# Altium schematic sheet [7] Jetson Nano P3.SchDoc: ARS Camera REV01 Jetson Nano P3
size A3; DrawnBy: Manh Ngo Van; Engineer: Manh Ngo Van; Organization: Altium Limited; Address1: L3, 12a Rodborough Rd; Address2: Frenchs Forest; Address3: NSW; Address4: Australia 2086; DocumentNumber: 7; Revision: 1.0; SheetNumber: 7; SheetTotal: 16
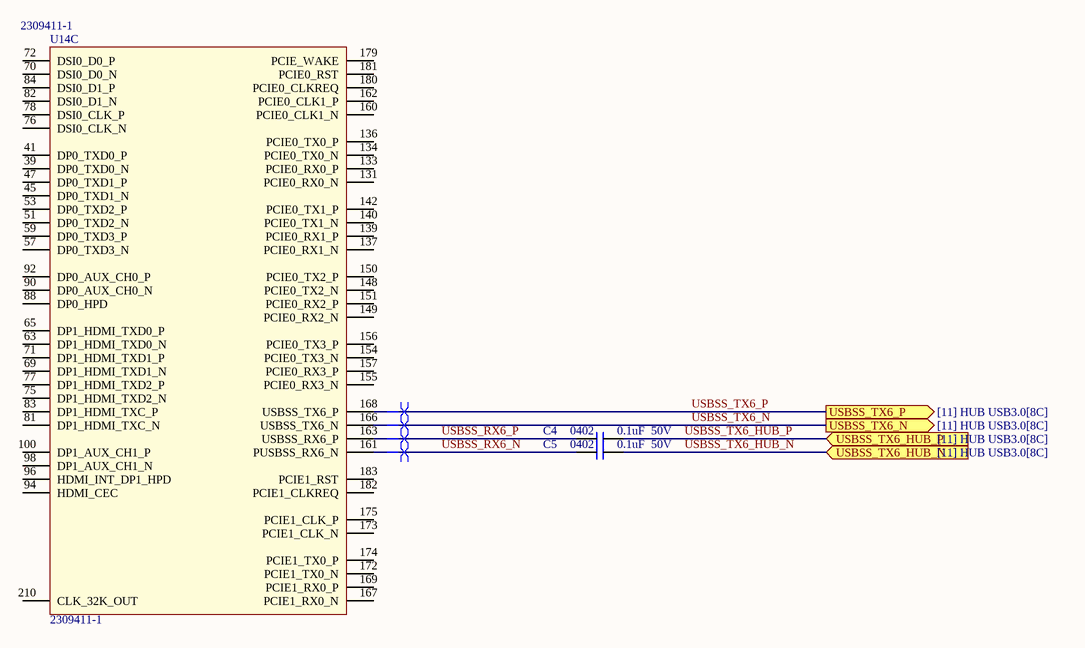
[diagram p0: [7] Jetson Nano P3.SchDoc]

## Parts
C4  0.1uF  Case/Package: 0402  Voltage: 50V  [C0402M]
C5  0.1uF  Case/Package: 0402  Voltage: 50V  [C0402M]
U14  2309411-1  [2309411-1]  (part C of 3)

## Ports
USBSS_TX6_HUB_N (in, see [11] HUB USB3.0[8C]), USBSS_TX6_HUB_P (in, see [11] HUB USB3.0[8C]), USBSS_TX6_N (out, see [11] HUB USB3.0[8C]), USBSS_TX6_P (out, see [11] HUB USB3.0[8C])

## Nets
USBSS_RX6_N: C5.1 U14.161(PUSBSS_RX6_N)
USBSS_RX6_P: C4.1 U14.163(USBSS_RX6_P)
USBSS_TX6_HUB_N: C5.2 ; port USBSS_TX6_HUB_N
USBSS_TX6_HUB_P: C4.2 ; port USBSS_TX6_HUB_P
USBSS_TX6_N: U14.166(USBSS_TX6_N) ; port USBSS_TX6_N
USBSS_TX6_P: U14.168(USBSS_TX6_P) ; port USBSS_TX6_P

Not connected (* = marked no-connect by the designer): U14 39(DP0_TXD0_N) 41(DP0_TXD0_P) 45(DP0_TXD1_N) 47(DP0_TXD1_P) 51(DP0_TXD2_N) 53(DP0_TXD2_P) 57(DP0_TXD3_N) 59(DP0_TXD3_P) 63(DP1_HDMI_TXD0_N) 65(DP1_HDMI_TXD0_P) 69(DP1_HDMI_TXD1_N) 70(DSI0_D0_N) 71(DP1_HDMI_TXD1_P) 72(DSI0_D0_P) 75(DP1_HDMI_TXD2_N) 76(DSI0_CLK_N) 77(DP1_HDMI_TXD2_P) 78(DSI0_CLK_P) 81(DP1_HDMI_TXC_N) 82(DSI0_D1_N) 83(DP1_HDMI_TXC_P) 84(DSI0_D1_P) 88(DP0_HPD) 90(DP0_AUX_CH0_N) 92(DP0_AUX_CH0_P) 94(HDMI_CEC) 96(HDMI_INT_DP1_HPD) 98(DP1_AUX_CH1_N) 100(DP1_AUX_CH1_P) 131(PCIE0_RX0_N) 133(PCIE0_RX0_P) 134(PCIE0_TX0_N) 136(PCIE0_TX0_P) 137(PCIE0_RX1_N) 139(PCIE0_RX1_P) 140(PCIE0_TX1_N) 142(PCIE0_TX1_P) 148(PCIE0_TX2_N) 149(PCIE0_RX2_N) 150(PCIE0_TX2_P) 151(PCIE0_RX2_P) 154(PCIE0_TX3_N) 155(PCIE0_RX3_N) 156(PCIE0_TX3_P) 157(PCIE0_RX3_P) 160(PCIE0_CLK1_N) 162(PCIE0_CLK1_P) 167(PCIE1_RX0_N) 169(PCIE1_RX0_P) 172(PCIE1_TX0_N) 173(PCIE1_CLK_N) 174(PCIE1_TX0_P) 175(PCIE1_CLK_P) 179(PCIE_WAKE) 180(PCIE0_CLKREQ) 181(PCIE0_RST) 182(PCIE1_CLKREQ) 183(PCIE1_RST) 210(CLK_32K_OUT)

## Layout directives
differential pair; differential pair class DIFF100; net class DIFF100: USBSS_RX6_N, USBSS_RX6_P, USBSS_TX6_N, USBSS_TX6_P

## Notes on the sheet
- Title:
- Size
- Document Number:
- Engineer:
- Drawn By:
- Rev:
- Date:
- A3
- Sheet
- of

## Library data of the parts
C4 C5 = CAP_CER: CAP CER 0.1UF 50V X7R 0402; Manufacturer: Murata; Manufacturer Part Number: GRM155R71H104KE14D; Material: Ceramic; Tolerance: 10%; Capacitance: 100nF; Dissipation Factor: 0.025%; ComponentLink1URL: https://datasheet.ciiva.com/25741/cl10b104kb8nnnl-25741341.pdf?src-supplier=Digi-Key; ComponentLink1Description: https://datasheet.ciiva.com/25741/cl10b104kb8nnnl-25741341.pdf?src-supplier=Digi-Key; ComponentLink2URL: https://datasheet.ciiva.com/26838/getdatasheetpartid-357523-26838415.pdf?src-supplier=Verical; ComponentLink2Description: https://datasheet.ciiva.com/26838/getdatasheetpartid-357523-26838415.pdf?src-supplier=Verical; Supplier 1: Digi-Key; Supplier Part Number 1: 490-10700-1-ND; Stock 1: 2282266; Pricing 1: 1 = 0.10000, 10 = 0.04600, 100 = 0.02050, 500 = 0.01464, 1000 = 0.01150, 2500 = 0.01045, 5000 = 0.00961 (USD); RoHS: Yes; Mount: Surface Mount; Weight: 0.000212oz; Case Code (Metric): 1005; Case Code (Imperial): 0402; Dielectric Material: Ceramic; Min Operating Temperature: -55°C; Max Operating Temperature: 125°C; Packaging: Tape and Reel; Dielectric: X7R; Voltage Rating: 50V; Termination: SMD/SMT; Composition: Ceramic; Voltage Rating (DC): 50V; Package Quantity: 10000; Length: 1mm; Height: 0.5mm; Width: 0.5mm; Thickness: 0.022inch; Depth: 0.5mm; REACH SVHC: No SVHC; Lead Free: Lead Free; ComponentLink3URL: http://www.farnell.com/datasheets/2079156.pdf?src-supplier=Farnell; ComponentLink3Description: http://www.farnell.com/datasheets/2079156.pdf?src-supplier=Farnell; ComponentLink4URL: http://www.mouser.com/ds/2/281/c02e-2905.pdf?src-supplier=Mouser; ComponentLink4Description: http://www.mouser.com/ds/2/281/c02e-2905.pdf?src-supplier=Mouser; ComponentLink5URL: http://components.arrow.com/part/dataview/0323_07030614?src-supplier=Arrow+Europe; ComponentLink5Description: http://components.arrow.com/part/dataview/0323_07030614?src-supplier=Arrow+Europe; ComponentLink6URL: https://search.murata.co.jp/Ceramy/image/img/A01X/G101/ENG/GRM155R71H104KE14-01.pdf?src-supplier=Digi-Key; ComponentLink6Description: https://search.murata.co.jp/Ceramy/image/img/A01X/G101/ENG/GRM155R71H104KE14-01.pdf?src-supplier=Digi-Key; ComponentLink7URL: http://psearch.en.murata.com/capacitor/product/GRM155R71H104KE14%23.pdf?src-supplier=Avnet; ComponentLink7Description: http://psearch.en.murata.com/capacitor/product/GRM155R71H104KE14%23.pdf?src-supplier=Avnet; ComponentLink8URL: http://www.farnell.com/datasheets/2079156.pdf?src-supplier=Element14; ComponentLink8Description: http://www.farnell.com/datasheets/2079156.pdf?src-supplier=Element14; ComponentLink9URL: http://www.farnell.com/datasheets/2079156.pdf?src-supplier=Newark; ComponentLink9Description: http://www.farnell.com/datasheets/2079156.pdf?src-supplier=Newark
U14 = Jetson Nano SODIMM: DDR4 SODIMM 260P 8.0H STD; Manufacturer: TE Connectivity; Contact Current Rating: 500mA; Circuit Application: Power; Connector System: Cable-to-Board; Number of Positions: 260; PCB Mount Retention: With; Sealable: No (Without); Row Spacing: 0.322inch; Pitch: 2.1mm; Stack Height: 0.157inch; Manufacturer Part Number: 2309411-1; RoHS: Yes; Category: Memory Connectors; Stock 1: 7189; Pricing 1: 1=1.40000, 10=1.22700, 25=1.15520, 50=1.10700, 100=1.05890 (USD); Mount: Surface Mount; Contact Plating: Gold; Contact Material: Copper Alloy; Housing Color: Black; Housing Material: Thermoplastic; Min Operating Temperature: -67°C; Max Operating Temperature: 185°C; Number of Rows: 2; Packaging: Tape and Reel; Package Quantity: 900; Flammability Rating: UL94 V-0; RoHS Compliant: Yes; ComponentLink1URL: https://www.te.com/commerce/DocumentDelivery/DDEController?Action=srchrtrv&amp;DocNm=2309407&amp;DocType=Customer+Drawing&amp;DocLang=English&src-supplier=Digi-Key; ComponentLink1Description: https://www.te.com/commerce/DocumentDelivery/DDEController?Action=srchrtrv&amp;DocNm=2309407&amp;DocType=Customer+Drawing&amp;DocLang=English&src-supplier=Digi-Key; ComponentLink2URL: https://www.te.com/commerce/DocumentDelivery/DDEController?Action=srchrtrv&DocNm=2309407&DocType=Customer+Drawing&DocLang=English&src-supplier=Digi-Key; ComponentLink2Description: https://www.te.com/commerce/DocumentDelivery/DDEController?Action=srchrtrv&DocNm=2309407&DocType=Customer+Drawing&DocLang=English&src-supplier=Digi-Key; Supplier 1: Arrow Electronics; Supplier Part Number 1: 2309411-1